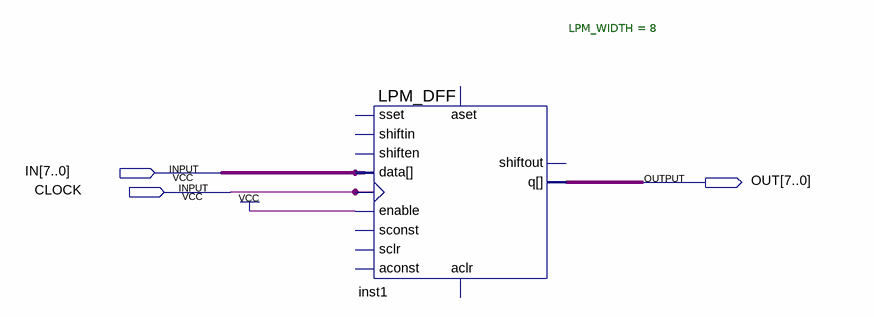
[diagram p0: schematic sheet]
// Quartus schematic PIPE.bdf as structural Verilog: 1 symbols, 3 pins
module PIPE (
  input  [7:0] IN,
  input  CLOCK,
  output [7:0] OUT
);

  LPM_DFF #(.LPM_WIDTH(8)) inst1 (
    .enable(1'b1), .clock(CLOCK), .data(IN), .q(OUT));  // open: shiftin, shiften, aconst, sclr, sconst, sset, aset, aclr, shiftout
endmodule
